# Altium project Bodemsensor.PrjPcb
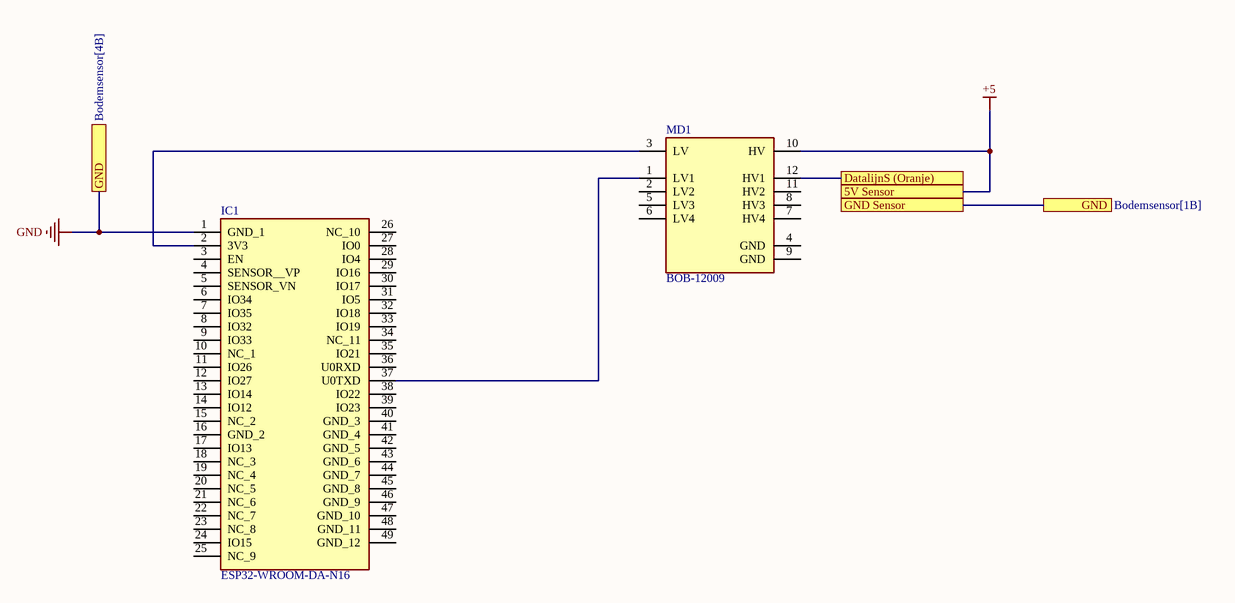
[diagram p0: Bodemsensor.SchDoc]
1 sheet, 2 parts. Net scope: flat (ports and power ports of the same name join across sheets).

## Sheet Bodemsensor.SchDoc: Aansluitingschema 1 Sensor
size A4; DrawnBy: Mangelschots Emiel; Revision: 1.0; SheetNumber: 1; SheetTotal: 1

### Parts
IC1  ESP32-WROOM-DA-N16  [ESP32WROOMDAN16]
MD1  BOB-12009  [FP-BOB-12009-MFG]

### Ports
5V Sensor, DatalijnS (Oranje), GND (see Bodemsensor[1B]), GND (see Bodemsensor[4B]), GND Sensor

### Nets
+5: MD1.10(HV) ; port 5V Sensor
GND: IC1.1(GND_1) ; port GND Sensor, port GND
NetIC1_2: IC1.2(3V3) MD1.3(LV)
NetIC1_37: IC1.37(U0TXD) MD1.1(LV1)
NetMD1_12: MD1.12(HV1) ; port DatalijnS (Oranje)

Not connected (* = marked no-connect by the designer): IC1 3(EN) 4(SENSOR__VP) 5(SENSOR_VN) 6(IO34) 7(IO35) 8(IO32) 9(IO33) 10(NC_1) 11(IO26) 12(IO27) 13(IO14) 14(IO12) 15(NC_2) 16(GND_2) 17(IO13) 18(NC_3) 19(NC_4) 20(NC_5) 21(NC_6) 22(NC_7) 23(NC_8) 24(IO15) 25(NC_9) 26(NC_10) 27(IO0) 28(IO4) 29(IO16) 30(IO17) 31(IO5) 32(IO18) 33(IO19) 34(NC_11) 35(IO21) 36(U0RXD) 38(IO22) 39(IO23) 40(GND_3) 41(GND_4) 42(GND_5) 43(GND_6) 44(GND_7) 45(GND_8) 46(GND_9) 47(GND_10) 48(GND_11) 49(GND_12); MD1 2(LV2) 4(GND) 5(LV3) 6(LV4) 7(HV4) 8(HV3) 9(GND) 11(HV2)

### Library data of the parts
IC1 = ESP32-WROOM-DA-N16: Integrated Circuit; Manufacturer_Name: Espressif Systems; Datasheet Link: https://www.google.com/url?sa=t&rct=j&q=&esrc=s&source=web&cd=&ved=2ahUKEwjogI6O69X0AhUU5eAKHZraCUwQFnoECCwQAQ&url=https%3A%2F%2Fwww.espressif.com%2Fsites%2Fdefault%2Ffiles%2Fdocumentation%2Fesp32-wroom-da_datasheet_en.pdf&usg=AOvVaw3br5-hykUip-1hiXiLK1oZ; Height: 3.65mm; Manufacturer_Part_Number: ESP32-WROOM-DA-N16; Mouser Part Number: 356-ESP32-WROOMDAN16; Mouser Price/Stock: https://www.mouser.co.uk/ProductDetail/Espressif-Systems/ESP32-WROOM-DA-N16?qs=A6eO%252BMLsxmTVM%252Ba16pxmOw%3D%3D
MD1 = CMP-157458-000001-1: LOGIC LEVEL CONVERTER - BI-DIREC; Logic Function: Translator